# EAGLE design usbasp-rev2 (EAGLE 6.4)
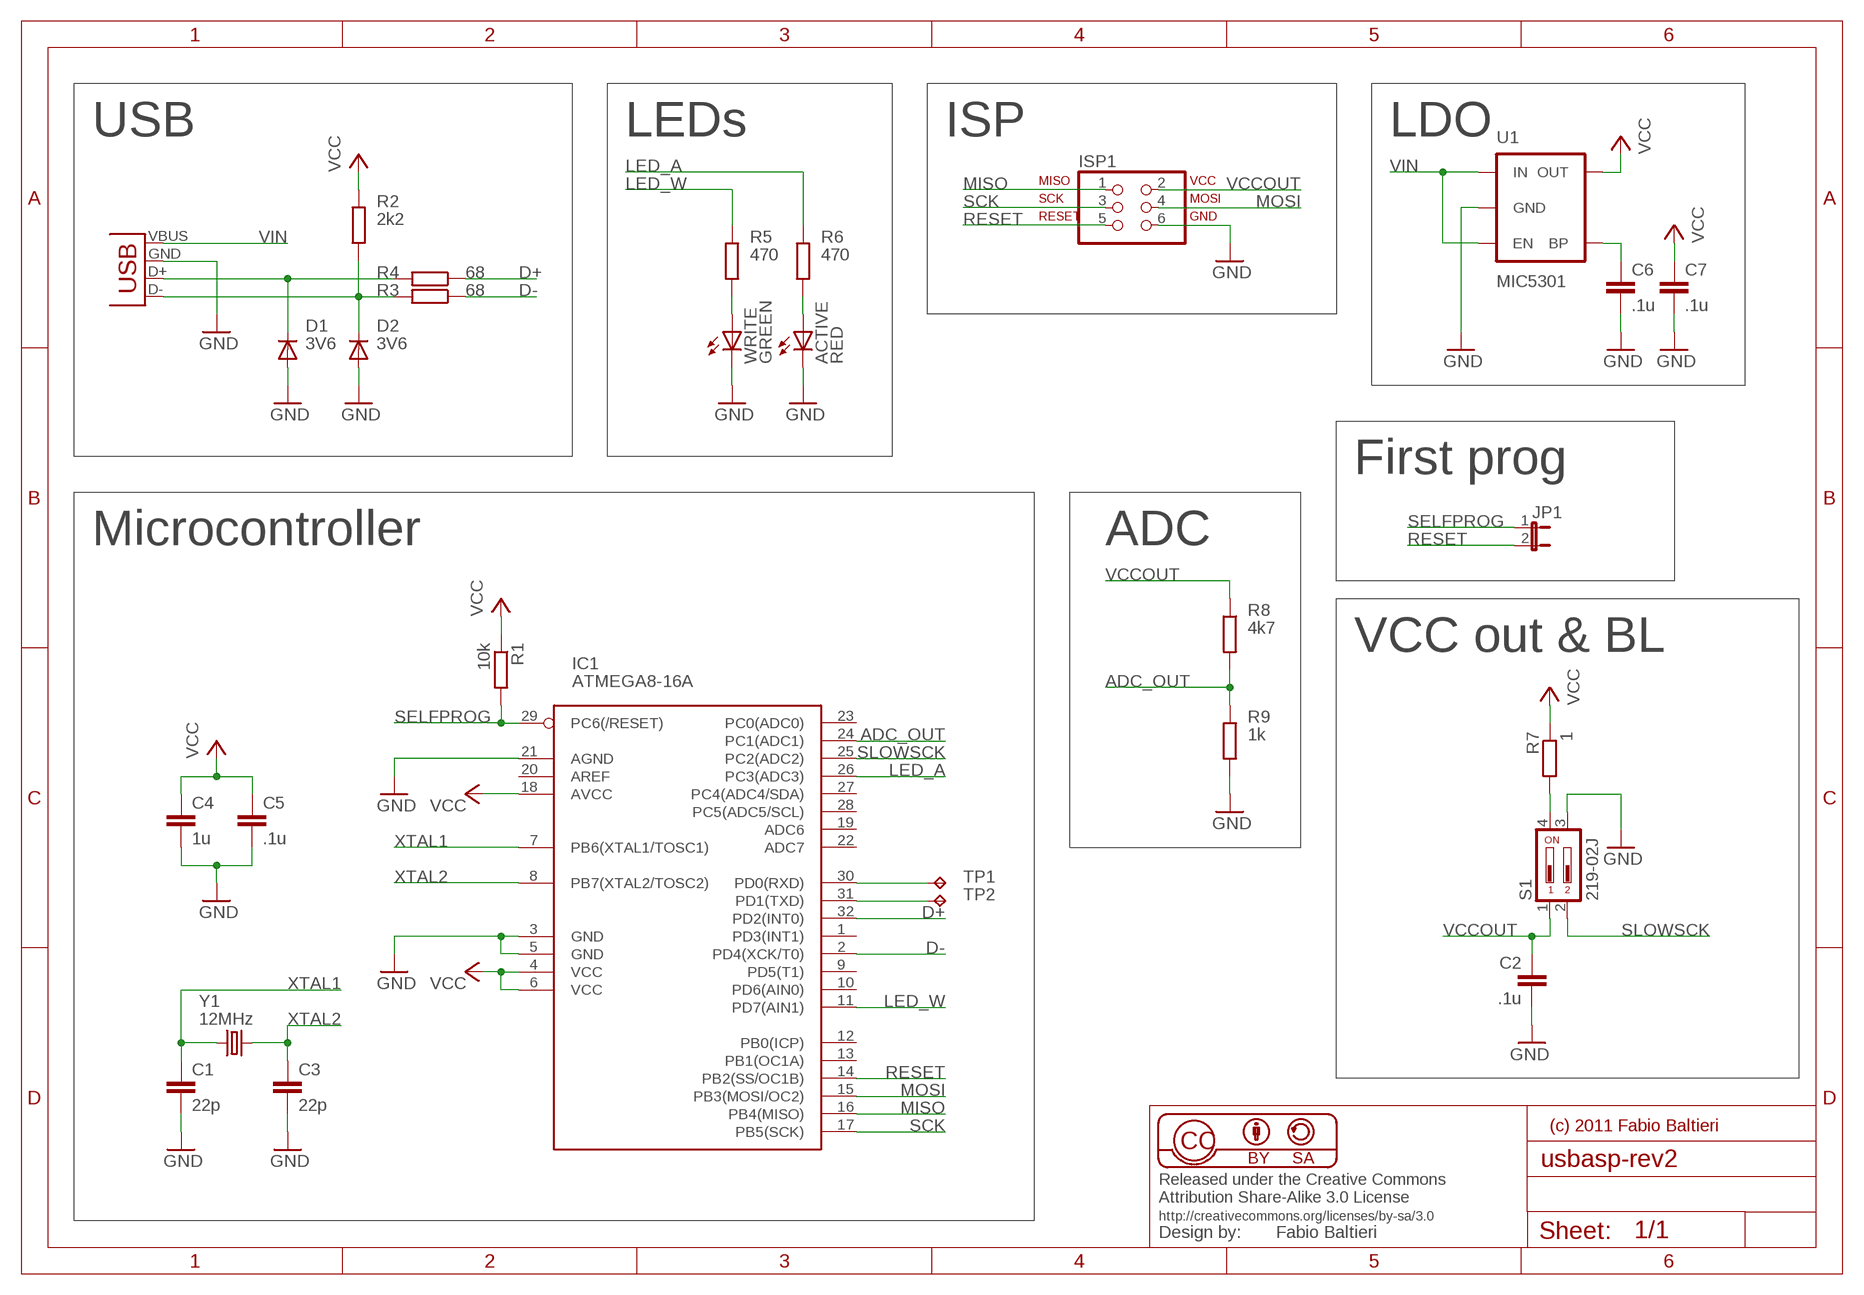
[diagram p0: schematic, sheet 1]

## Parts
ACTIVE  RED  LEDCHIP-LED0805  [CHIP-LED0805]
C1  22p  C-EUC0603  [C0603]
C2  .1u  C-EUC0603  [C0603]
C3  22p  C-EUC0603  [C0603]
C4  1u  C-EUC0603  [C0603]
C5  .1u  C-EUC0603  [C0603]
C6  .1u  C-EUC0603  [C0603]
C7  .1u  C-EUC0603  [C0603]
D1  3V6  DIODESMA  [SMA-DIODE]
D2  3V6  DIODESMA  [SMA-DIODE]
IC1  ATMEGA8-16A  [TQFP32-08]
ISP1  ISP-AVR910SMD  [2X03_BORDER]
JP1  JUMPER-2SMD-NO-NS  [SJ_2S-NO-NS]
R1  10k  R-EU_R0603  [R0603]
R2  2k2  R-EU_R0603  [R0603]
R3  68  R-EU_R0603  [R0603]
R4  68  R-EU_R0603  [R0603]
R5  470  R-EU_R0603  [R0603]
R6  470  R-EU_R0603  [R0603]
R7  1  R-EU_R0805  [R0805]
R8  4k7  R-EU_R0603  [R0603]
R9  1k  R-EU_R0603  [R0603]
S1  219-02J  [CTS-219-02J]
TP1  TPB1,27  [B1,27]
TP2  TPB1,27  [B1,27]
U1  MIC5301  V_REG_LDOSMD  [SOT23-5]
WRITE  GREEN  LEDCHIP-LED0805  [CHIP-LED0805]
X1  USB-A-H  [USB-A-H]
Y1  12MHz  CRYSTAL5X3  [CRYSTAL-SMD-5X3]

## Nets
ADC_OUT: IC1.24(PC1(ADC1)) R8.2 R9.1
D+: IC1.32(PD2(INT0)) R4.1
D-: IC1.2(PD4(XCK/T0)) R3.1
GND [POWER]: ACTIVE.C C1.1 C2.2 C3.1 C4.2 C5.2 C6.2 C7.2 D1.A D2.A IC1.3(GND) IC1.5(GND) IC1.21(AGND) ISP1.6 R9.2 S1.3 U1.2(GND) WRITE.C X1.GND(VBUS)
LED_A: IC1.26(PC3(ADC3)) R6.1
LED_W: IC1.11(PD7(AIN1)) R5.1
MISO: IC1.16(PB4(MISO)) ISP1.1
MOSI: IC1.15(PB3(MOSI/OC2)) ISP1.4
N$1: C6.1 U1.4(BP)
N$5: R5.2 WRITE.A
N$6: D1.C R4.2 X1.D+(D-)
N$7: D2.C R2.1 R3.2 X1.D-(D+)
N$8: ACTIVE.A R6.2
N$9: IC1.30(PD0(RXD)) TP1.TP
N$11 [POWER]: R7.2 S1.4
N$12: IC1.31(PD1(TXD)) TP2.TP
RESET: IC1.14(PB2(SS/OC1B)) ISP1.5 JP1.2
SCK: IC1.17(PB5(SCK)) ISP1.3
SELFPROG: IC1.29(PC6(/RESET)) JP1.1 R1.2
SLOWSCK: IC1.25(PC2(ADC2)) S1.2
VCC [POWER]: C4.1 C5.1 C7.1 IC1.4(VCC) IC1.6(VCC) IC1.18(AVCC) R1.1 R2.2 R7.1 U1.5(OUT)
VCCOUT [POWER]: C2.1 ISP1.2 R8.1 S1.1
VIN [POWER]: U1.1(IN) U1.3(EN) X1.VBUS(GND)
XTAL1: C1.2 IC1.7(PB6(XTAL1/TOSC1)) Y1.1
XTAL2: C3.2 IC1.8(PB7(XTAL2/TOSC2)) Y1.3
Unconnected: IC1.1(PD3(INT1)) IC1.9(PD5(T1)) IC1.10(PD6(AIN0)) IC1.12(PB0(ICP)) IC1.13(PB1(OC1A)) IC1.19(ADC6) IC1.20(AREF) IC1.22(ADC7) IC1.23(PC0(ADC0)) IC1.27(PC4(ADC4/SDA)) IC1.28(PC5(ADC5/SCL))

## Notes on the sheet
- USB | LEDs | ISP | LDO
- First prog
- Microcontroller | ADC
- VCC out & BL
- (c) 2011 Fabio Baltieri

## Library data of the parts
ACTIVE WRITE = led:LED: LED OSRAM: - CHIPLED LG R971, LG N971, LY N971, LG Q971, LY Q971, LO R971, LY R971 LH N974, LH R974 LS Q976, LO Q976, LY Q976 LO Q996 - Hyper CHIPLED LW Q18S LB Q993, LB Q99A, LB R99A - SideLED LS A670, LO A670, LY A670, LG A670, LP A670 LB A673, LV A673, LT A673, LW A673 LH A674 LY A675 LS A676, LA A676, LO A676, LY A676, LW A676 LS A679, LY A679, LG A679 - Hyper Micro SIDELED® LS Y876, LA Y876, LO Y876, LY Y876 LT Y87S - SmartLED LW L88C, LW L88S LB L89C, LB L89S, LG L890 LS L89K, LO L89K, LY L89K LS L896, LA L896, LO L896, LY L896 - TOPLED LS T670, LO T670, LY T670, LG T670, LP T670 LSG T670, LSP T670, LSY T670, LOP T670, LYG T670 LG T671, LOG T671, LSG T671 LB T673, LV T673, LT T673, LW T673 LH T674 LS T676, LA T676, LO T676, LY T676, LB T676, LH T676, LSB T676, LW T676 LB T67C, LV T67C, LT T67C, LS T67K, LO T67K, LY T67K, LW E67C LS E67B, LA E67B, LO E67B, LY E67B, LB E67C, LV E67C, LT E67C LW T67C LS T679, LY T679, LG T679 LS T770, LO T770, LY T770, LG T770, LP T770 LB T773, LV T773, LT T773, LW T773 LH T774 LS E675, LA E675, LY E675, LS T675 LS T776, LA T776, LO T776, LY T776, LB T776 LHGB T686 LT T68C, LB T68C - Hyper Mini TOPLED® LB M676 - Mini TOPLED Santana® LG M470 LS M47K, LO M47K, LY M47K Source: http://www.osram.convergy.de LUXEON: - LUMILED® LXK2-PW12-R00, LXK2-PW12-S00, LXK2-PW14-U00, LXK2-PW14-V00 LXK2-PM12-R00, LXK2-PM12-S00, LXK2-PM14-U00 LXK2-PE12-Q00, LXK2-PE12-R00, LXK2-PE12-S00, LXK2-PE14-T00, LXK2-PE14-U00 LXK2-PB12-K00, LXK2-PB12-L00, LXK2-PB12-M00, LXK2-PB14-N00, LXK2-PB14-P00, LXK2-PB14-Q00 LXK2-PR12-L00, LXK2-PR12-M00, LXK2-PR14-Q00, LXK2-PR14-R00 LXK2-PD12-Q00, LXK2-PD12-R00, LXK2-PD12-S00 LXK2-PH12-R00, LXK2-PH12-S00 LXK2-PL12-P00, LXK2-PL12-Q00, LXK2-PL12-R00 Source: www.luxeon.com KINGBRIGHT: KA-3528ASYC Source: www.kingbright.com
C1-C7 = rcl:C-EU: CAPACITOR, European symbol
D1 D2 = sparkfun:DIODE: Diode These are standard reverse protection diodes and small signal diodes. SMA package can handle up to about 1A. SOD-323 can handle about 200mA. What the SOD-323 package when ordering, there are some mfgs out there that are 5-pin packages.
IC1 = avr:ATMEGA8: MICROCONTROLLER 8 Kbytes FLASH 1 kbytes SRAM 512 bytes EEPROM USART 6-channel 10 bit ADC 2-channel 8 bit ADC
ISP1 = balto:ISP-AVR910: PIN HEADER
JP1 = SparkFun-Passives:JUMPER-2: Jumper Basic 0.1" spaced jumper. Use with breakaway headers.
R1-R9 = rcl:R-EU_: RESISTOR, European symbol
S1 = switch-dil:219-02*: Surface Mount DIP Switch Series 219 SMT CTS Electronic Components Sourc: www.ctscorp.com; OC_FARNELL: unknown; OC_NEWARK: unknown
TP1 TP2 = testpad:TP: Test pad
U1 = SparkFun-PowerIC:V_REG_LDO: Voltage Regulator LDO Standard 150mA LDO voltage regulator in SOT-23 layout. Micrel part MIC5205. BP (by-pass) pin is used to lower output noise with 470pF cap.
X1 = sparkfun:USB: USB Connectors USB-B-PTH is fully proven SKU : PRT-00139 USB-miniB is fully proven SKU : PRT-00587 USB-A-PCB is untested. USB-A-H is throughly reviewed, but untested. Spark Fun Electronics SKU : PRT-00437 USB-B-SMT is throughly reviewed, but untested. Needs silkscreen touching up. USB-A-S has not been used/tested USB-MB-H has not been used/tested
Y1 = SparkFun-FreqCtrl:CRYSTAL: Various standard crystals. Proven footprints. Spark Fun Electronics SKU : COM-00534

## Net classes
1 POWER: width 0.305 mm

## Board
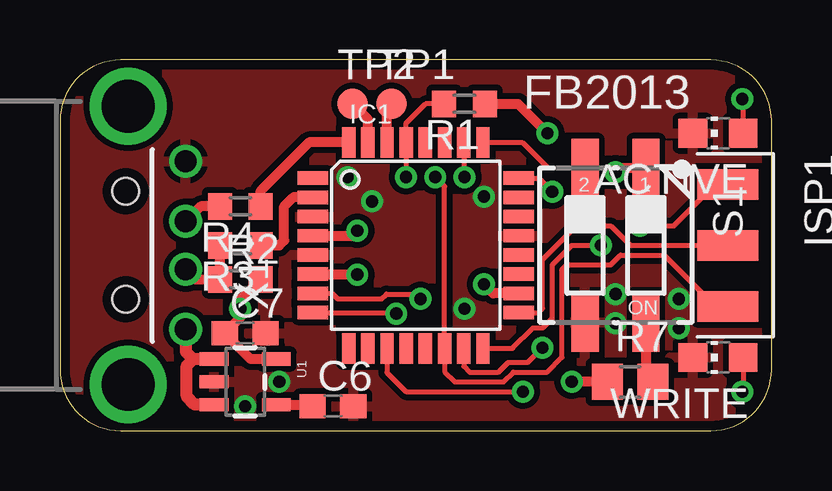
[diagram p1: board, top side]
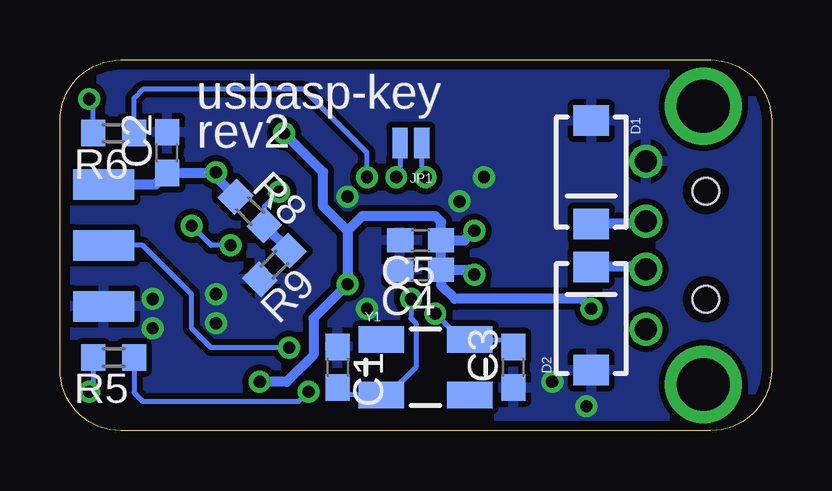
[diagram p2: board, bottom side, seen from below]

Size 29.67 x 15.44 mm. Coordinates in mm from the lower left corner, seen from the top.
Outline: 0,12.9 0,2.54 arc90 2.54,0 27.13,0 arc90 29.67,2.54 29.67,12.9 arc90 27.13,15.44 2.54,15.44 arc90 0,12.9
Copper layers (1*16): Top 0.035mm / dielectric 1.5mm / Bottom 0.035mm
Design rules "cm": minimum track width 8mil, minimum drill 20mil, track to track 8mil, track to pad 8mil, pad to pad 8mil, via to via 8mil, smd to smd 8mil, copper to edge 16mil, drill to drill 8mil, minimum pad ring 8mil, minimum via ring 8mil, stop-mask expansion 4mil, vias tented up to drill 20mil, thermal gap 10mil

### Footprints (pad centres in the part's own frame; a part is rotated, then mirrored left to right if it is on the bottom)
CHIP-LED0805 = smd 1.2 x 1.2: A 0,-1.05; C 0,1.05
C0603 = smd 1.1 x 1: 1 -0.85,0; 2 0.85,0
SMA-DIODE = smd 1.27 x 1.47: A -2.15,0; C 2.15,0
TQFP32-08 = smd 1.27 x 0.559: 1 -4.293,2.8; 2 -4.293,2; 3 -4.293,1.2; 4 -4.293,0.4; 5 -4.293,-0.4; 6 -4.293,-1.2; 7 -4.293,-2; 8 -4.293,-2.8; 17 4.293,-2.8; 18 4.293,-2; 19 4.293,-1.2; 20 4.293,-0.4; 21 4.293,0.4; 22 4.293,1.2; 23 4.293,2; 24 4.293,2.8 | smd 0.559 x 1.27: 9 -2.8,-4.293; 10 -2,-4.293; 11 -1.2,-4.293; 12 -0.4,-4.293; 13 0.4,-4.293; 14 1.2,-4.293; 15 2,-4.293; 16 2.8,-4.293; 25 2.8,4.293; 26 2,4.293; 27 1.2,4.293; 28 0.4,4.293; 29 -0.4,4.293; 30 -1.2,4.293; 31 -2,4.293; 32 -2.8,4.293
2X03_BORDER = smd 1.27 x 2.54: 1 -2.54,0; 3 0,0; 5 2.54,0 | smd 1.27 x 2.54 bottom: 2 -2.54,0; 4 0,0; 6 2.54,0
SJ_2S-NO-NS = smd 0.635 x 1.27: 1 -0.45,0; 2 0.45,0
R0603 = smd 1 x 1.1: 1 -0.85,0; 2 0.85,0
R0805 = smd 1.3 x 1.5: 1 -0.95,0; 2 0.95,0
CTS-219-02J = smd 1.13 x 2.44: 1 -1.27,-3.215; 2 1.27,-3.215; 3 1.27,3.215; 4 -1.27,3.215
B1,27 = smd 1.27 x 1.27: TP 0,0
SOT23-5 = smd 0.55 x 1.2: 1 -0.95,-1.3; 2 0,-1.3; 3 0.95,-1.3; 4 0.95,1.3; 5 -0.95,1.3
USB-A-H = drill 0.914: D+ 2.4,1; D- 2.4,-1; GND 2.4,3.5; VBUS 2.4,-3.5 | drill 2.2: GND@1 0,5.8; GND@2 0,-5.8 | hole 1.1: -0.1,2.25; -0.1,-2.25
CRYSTAL-SMD-5X3 = smd 1.9 x 1.1: 1 -1.85,-1.15; 2 1.85,-1.15; 3 1.85,1.15; 4 -1.85,1.15

### Placement (x,y rotation side)
ACTIVE  27.43,12.4 90 top
C1  18.08,2.64 270 bottom
C2  25.2,11.58 90 bottom
C3  10.77,2.64 90 bottom
C4  14.63,6.71 180 bottom
C5  14.63,7.92 180 bottom
C6  11.38,1.02 0 top
C7  7.72,4.06 0 top
D1  7.52,10.77 270 bottom
D2  7.52,4.67 90 bottom
IC1  14.83,7.72 0 top
ISP1  27.84,7.72 270 top
JP1  15.04,11.99 180 bottom
R1  16.87,13.61 180 top
R2  7.52,6.3 0 top
R3  7.52,7.72 180 top
R4  7.52,9.35 180 top
R5  27.43,3.05 180 bottom
R6  27.43,12.4 180 bottom
R7  23.77,2.03 0 top
R8  21.74,9.14 315 bottom
R9  20.73,6.91 225 bottom
S1  23.16,7.72 180 top
TP1  13.82,13.61 0 top
TP2  12.19,13.61 0 top
U1  7.72,2.03 270 top
WRITE  27.43,3.05 90 top
X1  2.84,7.72 0 top
Y1  14.43,2.64 0 bottom

### Tracks (layer width: path | path; a pad name or v marks a point on that pad's centre or on a via)
ADC_OUT  (via drill 0.51)
  Top 0.203: IC1.24 19.96,10.52 v20.52,9.96
  Bottom 0.203: R8.2 21.14,9.34 v20.52,9.96
  Bottom 0.406: R8.2 20.12,7.53 R9.1
D+
  Top 0.406: IC1.32 10.39,12.01 8.37,9.99 R4.1
D-
  Top 0.406: R3.1 9.14,7.72 9.35,7.92 9.35,9.35 9.72,9.72 IC1.2
GND  (via drill 0.51)
  other vias: 11.99,10.57 13,9.55 23.16,4.47 17.68,9.75 16.87,5.08 25.81,4.27 9.14,2.03 23.16,5.69 25.81,5.49 7.72,1.02
  pour Bottom (isolate 0.254): -0.2,15.65 29.87,15.65 29.87,-0.2 -0.2,-0.2
  pour Top (isolate 0.254): -0.41,15.85 30.07,15.85 30.07,-0.41 -0.41,-0.41
LED_A  (via drill 0.51)
  Top 0.203: IC1.26 16.83,10.6 v16.87,10.57
  Bottom 0.203: v16.87,10.57 16.87,11.58 19.51,14.22 26.21,14.22 26.58,13.86 R6.1
LED_W  (via drill 0.51)
  Top 0.203: IC1.11 13.63,2.42 14.43,1.63 v19.3,1.63
  Bottom 0.203: R5.1 26.58,1.59 26.21,1.22 19.71,1.22 v19.3,1.63
MISO  (via drill 0.51)
  Top 0.203: v22.55,7.72 21.34,7.72 20.52,6.91 20.52,4.67 20.12,4.27 19.71,4.27 18.87,3.43 IC1.16 | v24.18,8.53 25.6,8.53 27.33,10.26 ISP1.1
  Bottom 0.203: v22.55,7.72 23.37,7.72 v24.18,8.53
MOSI  (via drill 0.51)
  Top 0.203: IC1.15 16.83,2.67 17.07,2.44 18.29,2.44 18.69,2.85 19.51,2.85 v20.12,3.45
  Bottom 0.203: v20.12,3.45 23.37,3.45 24.18,4.27 24.18,5.69 26.21,7.72 ISP1.4
N$1
  Top 0.406: U1.4 10.46,1.08 C6.1
N$5  (via drill 0.51)
  Top 0.203: WRITE.A 28.48,1.66 v28.45,1.63
  Bottom 0.203: R5.2 28.28,1.79 v28.45,1.63
N$6
  Top 0.406: R4.2 5.87,9.35 X1.D+
  Bottom 0.406: X1.D+ 5.35,8.62 D1.C
N$7
  Top 0.406: R3.2 R2.1 5.67,6.3 X1.D-
  Bottom 0.406: X1.D- 5.35,6.82 D2.C
N$8  (via drill 0.51)
  Top 0.203: ACTIVE.A 28.48,13.78 v28.45,13.82
  Bottom 0.203: R6.2 28.28,13.65 v28.45,13.82
N$9
  Top 0.406: IC1.30 13.63,13.43 TP1.TP
N$11
  Top 0.406: S1.4 24.43,2.32 R7.2
N$12
  Top 0.406: IC1.31 12.83,12.97 TP2.TP
RESET  (via drill 0.51)
  Top 0.203: v15.65,10.57 16.03,10.18 IC1.14 16.03,2.46 16.46,2.03 18.49,2.03 18.9,2.44 20.32,2.44 20.93,3.05 20.93,6.71 21.13,6.91 22.96,6.91 23.37,7.32 25.2,7.32 27.33,5.18 ISP1.5
  Bottom 0.203: JP1.2 15.49,10.73 v15.65,10.57
SCK
  Top 0.203: IC1.17 19.96,4.92 20.12,5.08 20.12,7.11 21.54,8.53 22.96,8.53 23.77,7.72 ISP1.3
SELFPROG  (via drill 0.51)
  Top 0.203: R1.2 15.24,13.61 14.43,12.81 IC1.29 v14.43,10.57
  Bottom 0.203: JP1.1 14.59,10.73 v14.43,10.57
SLOWSCK
  Top 0.203: IC1.25 19.28,12.01 20.36,10.94 S1.2
VCC  (via drill 0.51)
  Top 0.406: U1.5 7.95,2.98 C7.1 7.52,4.71 v7.52,5.08 7.52,5.45 R2.2 | IC1.4 12.19,8.12 v12.39,8.33 | IC1.6 12.38,6.52 v12.39,6.5 | R7.1 v21.34,2.03 | IC1.18 18.05,5.72 v17.68,6.1 | R1.1 19.1,13.61 v20.32,12.39
  Bottom 0.406: C4.1 C5.1 | v7.52,5.08 7.92,5.49 13.21,5.49 13.78,6.06 C4.1 | C4.1 12.6,6.71 v12.39,6.5 | C5.1 12.8,7.92 v12.39,8.33 | C5.1 13.78,8.7 14.02,8.94 17.07,8.94 17.68,8.33 | 17.68,8.33 v17.68,6.1 19.1,4.67 19.1,3.15 20.22,2.03 v21.34,2.03 | 17.68,8.33 18.69,9.35 18.69,10.77 v20.32,12.39
VCCOUT  (via drill 0.51)
  Top 0.406: S1.1 23.33,10.94 v23.16,10.77
  Bottom 0.406: ISP1.2 25.67,10.26 C2.1 23.2,10.73 v23.16,10.77 23.16,10.57 R8.1
VIN
  Top 0.508: X1.VBUS 5.25,3.29 5.55,2.98 | U1.1 5.55,2.98 | U1.3 5.62,1.08 5.28,1.42 5.28,2.71 5.55,2.98
XTAL1  (via drill 0.51)
  Top 0.203: IC1.7 11.35,5.72 11.58,5.49 13.41,5.49 13.61,5.69 14.83,5.69 v15.04,5.49
  Bottom 0.203: C1.2 17.79,1.49 Y1.1 15.98,1.49 14.83,2.64 14.83,4.47 15.04,4.67 v15.04,5.49
XTAL2  (via drill 0.51)
  Top 0.203: IC1.8 13.98,4.92 v14.02,4.88
  Bottom 0.203: C3.2 11.07,3.79 Y1.3 12.94,3.79 v14.02,4.88

### Text on the board
_tsilk: FB2013
_bsilk: usbasp-key | rev2